# Altium schematic sheet Earthnet.SchDoc
size A4
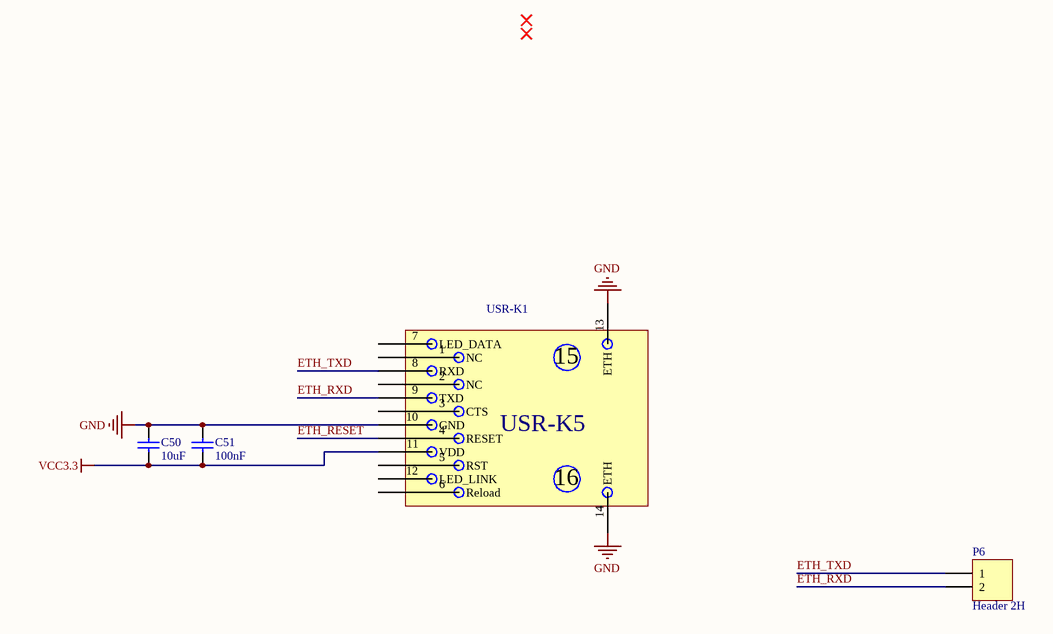
[diagram p0: Earthnet.SchDoc]

## Parts
C50  10uF  [C 0603_M]
C51  100nF  [C 0603_M]
P6  Header 2H  [HDR2.54-LI-2P]
USR-K1  USR-K5  [USR-K3 V2]  (value not drawn)

## Nets
GND: C50.2 C51.2 USR-K1.10(GND) USR-K1.13(ETH) USR-K1.14(ETH)
VCC3.3: C50.1 C51.1 USR-K1.11(VDD)
ETH_RESET: USR-K1.4(RESET)
ETH_RXD: P6.2 USR-K1.9(TXD)
ETH_TXD: P6.1 USR-K1.8(RXD)

Not connected (* = marked no-connect by the designer): USR-K1 1(NC) 2(NC) 3(CTS) 5(RST) 6(Reload) 7(LED_DATA) 12(LED_LINK)

## Notes on the sheet
- (in symbol USR-K5) 15; 16

## Library data of the parts
C50 = Cap: 10uF/6V3/10%; Published: 8-Jun-2000; LatestRevisionDate: 17-Jul-2002; LatestRevisionNote: Re-released for DXP Platform.; PackageReference: RAD-0.3; Publisher: Altium Limited; Value: 10uF
C51 = Cap: 100nF/50V/10%; Published: 8-Jun-2000; LatestRevisionDate: 17-Jul-2002; LatestRevisionNote: Re-released for DXP Platform.; PackageReference: RAD-0.3; Publisher: Altium Limited; Value: 100nF
P6 = Header 2H: Header, 2-Pin, Right Angle; LatestRevisionDate: 17-Jul-2002; LatestRevisionNote: Re-released for DXP Platform.; Publisher: Altium Limited